# Altium schematic sheet nrf52840_qiaa_var6.SchDoc: nRF52840-QIAA Ref. Layout (LDO only, VDD supply, No USB)
size A4; Revision: 1.1; SheetNumber: 1; SheetTotal: 1; DrawnBy: RUBR; DocumentSize: A4; PCAName: nRF52840-QIAA Ref. Layout (LDO only, VDD supply)
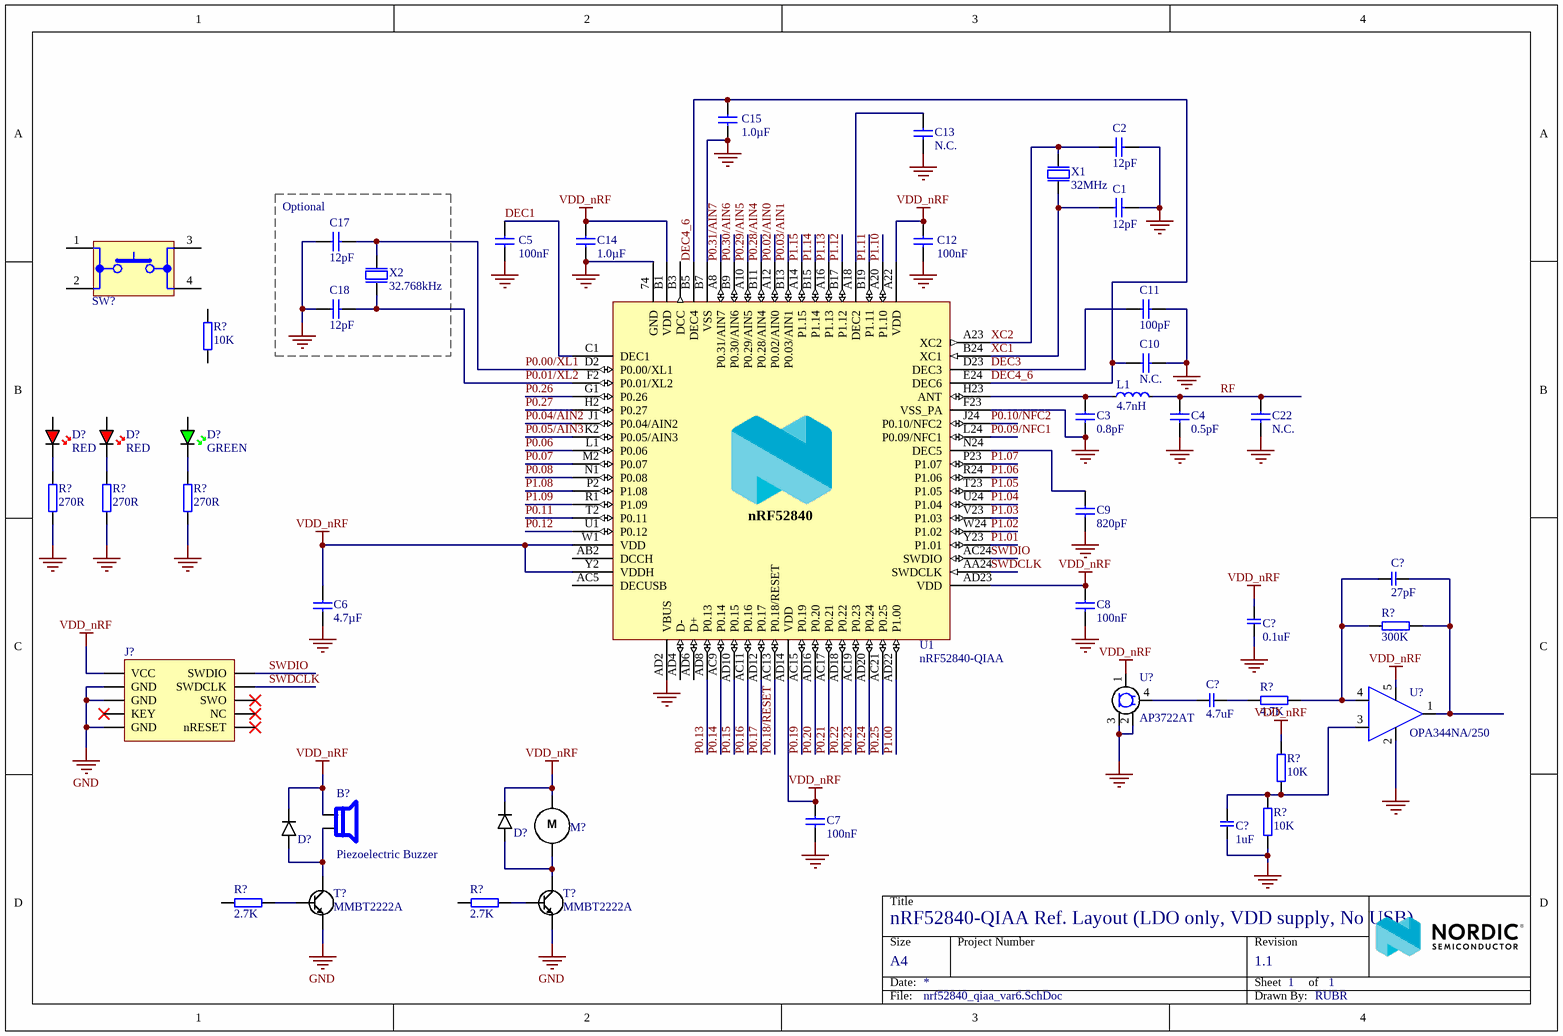
[diagram p0: nrf52840_qiaa_var6.SchDoc]

## Parts
(Parts that share a designator on the sheet are numbered #1, #2 ... from top to bottom, then left to right.)
B?  Piezoelectric Buzzer
C1  12pF  [CAPC1005X04L]
C2  12pF  [CAPC1005X04L]
C3  0.8pF  [CAPC1005X04L]
C4  0.5pF  [CAPC1005X04L]
C5  100nF  [CAPC1005X04L]
C6  4.7µF  [CAPC1608X06L]
C7  100nF  [CAPC1005X04L]
C8  100nF  [CAPC1005X04L]
C9  820pF  [CAPC1005X04L]
C10  N.C.  [CAPC1005X04L]
C11  100pF  [CAPC1005X04L]
C12  100nF  [CAPC1005X04L]
C13  N.C.  [CAPC1005X04L]
C14  1.0µF  [CAPC1608X06L]
C15  1.0µF  [CAPC1608X06L]
C17  12pF  [CAPC1005X04L]
C18  12pF  [CAPC1005X04L]
C22  N.C.  [CAPC1005X04L]
C?#1  27pF  [C0805]
C?#2  0.1uF  [C0805]
C?#3  4.7uF  [C0805]
C?#4  1uF  [C0805]
D?#1  RED  [1206_RED]
D?#2  RED  [1206_RED]
D?#3  GREEN  [1206_GREEN]
D?#4  S1AL  [S1AL]  (value not drawn)
D?#5  S1AL  [S1AL]  (value not drawn)
J?  CONN HEADER SMD 10POS 1.27MM  [Conn_02x05_Odd_Even]  (value not drawn)
L1  4.7nH  [INDC1005X04L]
M?  Motor  [F_HDR_1X2]  (value not drawn)
R?#1  10K  [R0805]
R?#2  270R  [R0805]
R?#3  270R  [R0805]
R?#4  270R  [R0805]
R?#5  300K  [R0805]
R?#6  4.7K  [R0805]
R?#7  10K  [R0805]
R?#8  10K  [R0805]
R?#9  2.7K  [R0805]
R?#10  2.7K  [R0805]
SW?  1825910-6  [Push_Button_SMD_4.5X4.5]  (value not drawn)
T?#1  MMBT2222A  [MMBT2222A]
T?#2  MMBT2222A  [MMBT2222A]
U1  nRF52840-QIAA  [AQFN50P700X700X85_HS-74N]
U?#1  AP3722AT  [AP3722AT]
U?#2  OPA344NA/250  [SOT-23-5]
X1  32MHz  [BT-XTAL_2016]
X2  32.768kHz  [XTAL_3215]

## Blocks framed on the sheet
Optional: C17 C18 X2

## Nets
GND: C1.2 C2.2 C3.1 C4.1 C5.2 C6.2 C7.2 C8.2 C9.2 C10.1 C11.2 C12.2 C13.2 C14.2 C15.1 C17.2 C18.2 C22.2 C?#2.1 C?#4.1 J?.3(GND) J?.5(GND) J?.9(GND) R?#2.2(100R) R?#3.2(100R) R?#4.2(100R) R?#8.2(100R) T?#1.2 T?#2.2 U1.74(GND) U1.AD2(VBUS) U1.B7(VSS) U1.F23(VSS_PA) U?#1.2(GND) U?#1.3(GND) U?#2.2(VEE) X1.2(GND) X1.4(GND)
VDD_nRF: B?.1 C6.1 C7.1 C8.1 C12.1 C14.1 C?#2.2 D?#4.K D?#5.K J?.1(VCC) M?.1 R?#7.1 U1.A22(VDD) U1.AD14(VDD) U1.AD23(VDD) U1.B1(VDD) U1.W1(VDD) U1.Y2(VDDH) U?#1.1(VDD) U?#2.5(VCC)
DEC1: C5.1 U1.C1(DEC1)
DEC3: C11.1 U1.D23(DEC3)
DEC4_6: C10.2 C15.2 U1.B5(DEC4) U1.E24(DEC6)
P0.00/XL1: C17.1 U1.D2(P0.00/XL1) X2.1(inp)
P0.01/XL2: C18.1 U1.F2(P0.01/XL2) X2.2(out)
P0.02/AIN0: U1.A12(P0.02/AIN0)
P0.03/AIN1: U1.B13(P0.03/AIN1)
P0.04/AIN2: U1.J1(P0.04/AIN2)
P0.05/AIN3: U1.K2(P0.05/AIN3)
P0.06: U1.L1(P0.06)
P0.07: U1.M2(P0.07)
P0.08: U1.N1(P0.08)
P0.09/NFC1: U1.L24(P0.09/NFC1)
P0.10/NFC2: U1.J24(P0.10/NFC2)
P0.11: U1.T2(P0.11)
P0.12: U1.U1(P0.12)
P0.13: U1.AD8(P0.13)
P0.14: U1.AC9(P0.14)
P0.15: U1.AD10(P0.15)
P0.16: U1.AC11(P0.16)
P0.17: U1.AD12(P0.17)
P0.18/RESET: U1.AC13(P0.18/RESET)
P0.19: U1.AC15(P0.19)
P0.20: U1.AD16(P0.20)
P0.21: U1.AC17(P0.21)
P0.22: U1.AD18(P0.22)
P0.23: U1.AC19(P0.23)
P0.24: U1.AD20(P0.24)
P0.25: U1.AC21(P0.25)
P0.26: U1.G1(P0.26)
P0.27: U1.H2(P0.27)
P0.28/AIN4: U1.B11(P0.28/AIN4)
P0.29/AIN5: U1.A10(P0.29/AIN5)
P0.30/AIN6: U1.B9(P0.30/AIN6)
P0.31/AIN7: U1.A8(P0.31/AIN7)
P1.00: U1.AD22(P1.00)
P1.01: U1.Y23(P1.01)
P1.02: U1.W24(P1.02)
P1.03: U1.V23(P1.03)
P1.04: U1.U24(P1.04)
P1.05: U1.T23(P1.05)
P1.06: U1.R24(P1.06)
P1.07: U1.P23(P1.07)
P1.08: U1.P2(P1.08)
P1.09: U1.R1(P1.09)
P1.10: U1.A20(P1.10)
P1.11: U1.B19(P1.11)
P1.12: U1.B17(P1.12)
P1.13: U1.A16(P1.13)
P1.14: U1.B15(P1.14)
P1.15: U1.A14(P1.15)
RF: C4.2 C22.1 L1.2
SWDCLK: J?.4(SWDCLK) U1.AA24(SWDCLK)
SWDIO: J?.2(SWDIO) U1.AC24(SWDIO)
XC1: C1.1 U1.B24(XC1) X1.1(inp)
XC2: C2.1 U1.A23(XC2) X1.3(out)
NetB?_2: B?.2 D?#5.A T?#1.3
NetC3_2: C3.2 L1.1 U1.H23(ANT)
NetC9_1: C9.1 U1.N24(DEC5)
NetC13_1: C13.1 U1.A18(DEC2)
NetC?#1_1: C?#1.1 R?#5.1 R?#6.2(100R) U?#2.4(V-)
NetC?#1_2: C?#1.2 R?#5.2(100R) U?#2.1(OUT)
NetC?#3_1: C?#3.1 U?#1.4(OUT)
NetC?#3_2: C?#3.2 R?#6.1
NetC?#4_2: C?#4.2 R?#7.2(100R) R?#8.1 U?#2.3(V+)
NetD?#1_K: D?#1.K R?#2.1
NetD?#2_K: D?#2.K R?#3.1
NetD?#3_K: D?#3.K R?#4.1
NetD?#4_A: D?#4.A M?.2 T?#2.3
NetR?#9_2: R?#9.2(100R) T?#1.1
NetR?#10_2: R?#10.2(100R) T?#2.1

Not connected (* = marked no-connect by the designer): D?#1 A; D?#2 A; D?#3 A; J? 6(SWO)* 7(KEY)* 8(NC)* 10(nRESET)*; R?#1 1 2(100R); R?#9 1; R?#10 1; SW? 1 2 3 4; U1 AB2(DCCH) AC5(DECUSB) AD4(D-) AD6(D+) B3(DCC)

## Notes on the sheet
- Title
- Size
- Date:
- A4
- Project Number
- Sheet         of
- Revision
- File:
- Drawn By:
- (in symbol Motor) M
- (in symbol nRF52840-QIAAD0) nRF52840

## Library data of the parts
B? = GSC14045YB-3V4000: NO 4000±500Hz 75dB @ 3V, 10cm Piezo 3V 14mm x 14mm SMD,14x14x4mm Buzzers ROHS
C1 C2 C17 C18 = C0402-12p: Capacitor, NP0, ±2%; Note: 50V; Part Number: C0402-12p; LatestRevisionDate: 2011-05-11; Pin Count: 2; Publisher: Nordic Semiconductor; Published: 2009-05-08; Value: 12pF; Footprint Doc: 0402
C3 = C0402-0.8p: Capacitor, NP0, ±10%; Note: 50V; Part Number: C0402-0.8p; LatestRevisionDate: 2012-11-21; Pin Count: 2; Publisher: Nordic Semiconductor; Published: 2009-05-08; Value: 0.8pF; Footprint Doc: 0402
C4 = C0402-0.5p: Capacitor, NP0, ±10%; Note: 50V; Part Number: C0402-0.5p; LatestRevisionDate: 2017-02-23; Pin Count: 2; Publisher: Nordic Semiconductor; Published: 2009-05-08; Value: 0.5pF; Footprint Doc: 0402
C5 C7 C8 C12 = C0402-100n: Capacitor, X7R, ±10%; Note: 16V; Part Number: C0402-100n; LatestRevisionDate: 2009-11-23; Pin Count: 2; Publisher: Nordic Semiconductor; Published: 2009-05-08; Value: 100nF; Footprint Doc: 0402
C6 = C0603-4µ7-6.3V-X7R: Capacitor, X7R, ±10%; Note: 6.3V; Part Number: C0603-4µ7-6.3V-X7R; LatestRevisionDate: 2015-06-10; Pin Count: 2; Publisher: Nordic Semiconductor; Published: 2015-06-10; Value: 4.7µF; Footprint Doc: 0603
C9 = C0402-820p: Capacitor, NP0, ±5%; Note: 50V; Part Number: C0402-820p; LatestRevisionDate: 2009-05-08; Pin Count: 2; Publisher: Nordic Semiconductor; Published: 2009-05-08; Value: 820pF; Footprint Doc: 0402
C10 C13 = C0402-N.C.: Not mounted; Assembly: Not mounted; Part Number: C0402-N.C.; LatestRevisionDate: 2009-05-08; Pin Count: 2; Publisher: Nordic Semiconductor; Published: 2009-05-08; Value: N.C.; Footprint Doc: 0402
C11 = C0402-100p: Capacitor, NP0, ±5%; Note: 50V; Part Number: C0402-100p; LatestRevisionDate: 2009-05-08; Pin Count: 2; Publisher: Nordic Semiconductor; Published: 2009-05-08; Value: 100pF; Footprint Doc: 0402
C14 C15 = C0603-1µ0: Capacitor, X7R, ±10%; Note: 16V; Part Number: C0603-1µ0; LatestRevisionDate: 2013-06-05; Pin Count: 2; Publisher: Nordic Semiconductor; Published: 2009-05-08; Value: 1.0µF; Footprint Doc: 0603
C22 = C0402-N.C.: Not mounted; Note: Chip Cap; Assembly: Not mounted; Part Number: C0402-N.C.; LatestRevisionDate: 2009-05-08; Pin Count: 2; Publisher: Nordic Semiconductor; Published: 2009-05-08; Value: N.C.; Footprint Doc: 0402
D?#1 D?#2 = MHS110KECT: Red 617.5~629.5nm 1.8V - 1204 Light Emitting Diodes (LED) ROHS
D?#3 = TJ-S3210SW5TGLC7K-A5: Green-yellow 565~575nm 1.8~2.4V - SMD Light Emitting Diodes (LED) ROHS
D?#4 D?#5 = S1AL: Manufacturer: Taiwan Semiconductor; Manufacturer Part Number: RS1AL RVG; Supplier 1: Digi-Key; RoHS: Yes; Stock 1: 64; Pricing 1: 1=0.40000, 10=0.32100, 100=0.21860, 500=0.16394, 1000=0.12296 (USD); RoHS Compliant: Yes; Supplier Part Number 1: RS1ALRVGCT-ND
J? = Conn_02x05_Odd_Even: Mini SWD 0.05" Pitch Connector - 10 Pin SMT Box Header; Manufacturer: Adafruit Industries; Manufacturer Part Number: 4048; Supplier 1: Digi-Key; RoHS: No; Category: Connectors; Stock 1: 76; Pricing 1: 1=1.95000 (USD); ComponentLink1URL: https://media.digikey.com/pdf/Data%20Sheets/Adafruit%20PDFs/4048_Web.pdf?src-supplier=Digi-Key; ComponentLink1Description: https://media.digikey.com/pdf/Data%20Sheets/Adafruit%20PDFs/4048_Web.pdf?src-supplier=Digi-Key; Supplier Part Number 1: 1528-2827-ND
L1 = L0402-4n7: High frequency chip inductor ±5%; Part Number: L0402-4n7; LatestRevisionDate: 2012-09-19; Pin Count: 2; Publisher: Nordic Semiconductor; Published: 2009-05-08; Value: 4.7nH; Note: High frequency chip inductor ±5%; Footprint Doc: 0402
R?#9 R?#10 = R0805_2K7: RES SMD 2.7K OHM 1% 1/8W 0805; Manufacturer: Yageo; Manufacturer Part Number: AC0805FR-072K7L; Resistance: 2.7kR; Power Rating: 125mW; Voltage Rating: 150V; Temperature Coefficient: 100ppm/°C; Supplier 1: Digi-Key; RoHS: Yes; Category: Chip SMD Resistors; Stock 1: 3849; Pricing 1: 1=0.10000, 10=0.05000, 100=0.02040, 1000=0.00917, 2500=0.00796 (USD); Case/Package: 0805; Case Code (Imperial): 0805; Case Code (Metric): 2012; Size Code: 0805; Min Operating Temperature: -55°C; Max Operating Temperature: 155°C; Tolerance: 1%; Packaging: Tape and Reel; Resistor Type: Thick Film; Number of Terminations: 2; Termination: SMD/SMT; Max Power Dissipation: 125mW; Features: Moisture Resistant,Automotive AEC-Q200; Series: AC; Length: 0.079inch; Width: 0.049inch; Height: 0.024inch; Lead Free: Lead Free; RoHS Compliant: Yes; ComponentLink1URL: https://datasheet.ciiva.com/12656/pyu-ac-51-rohs-l-2-12656732.pdf?src-supplier=Mouser; ComponentLink1Description: https://datasheet.ciiva.com/12656/pyu-ac-51-rohs-l-2-12656732.pdf?src-supplier=Mouser; Supplier Part Number 1: YAG3717CT-ND
SW? = Push Button: Switch Push Button OFF (ON) SPST Round Button 0.05A 24VDC Momentary Contact PC Pins Thru-Hole; Manufacturer: TE Connectivity Alcoswitch; Actuator Material: PBT; Mechanical Life: 100000Cycles; Operating Force: 160gf; Illumination Type: Illuminated,Non-Illuminated; Switch Travel: 0.25mm; Switch Function: Off-Mom; Actuator Type: Standard; Max Voltage Rating (DC): 24V; Contact Current Rating: 50mA; Contact Resistance: 100mR; Actuator Length: 0.055inch; Supplier 1: Digi-Key; Stock 1: 56143; Pricing 1: 1=0.1, 10=0.093, 25=0.0892, 50=0.0862, 100=0.0814, 250=0.0766, 500=0.0734, 1000=0.05584, 5000=0.04627 (USD); Mount: Through Hole; Contact Material: Copper Alloy; Contact Plating: Silver; Min Operating Temperature: -35°C; Max Operating Temperature: 85°C; Throw Configuration: SPST; Packaging: Loose Piece; Termination: PC Pins; Package Quantity: 750; Orientation: Straight; Electrical Life: 100000Cycles; Type: Switch; Max Current Rating: 50mA; Length: 5.99mm; REACH SVHC: Unknown; ELV: Compliant; Lead Free: Lead Free; ComponentLink1URL: http://www.onlinecomponents.com/productFiles/mf-AMP/1825910-6rqpn1825910-6.pdf; ComponentLink1Description: http://www.onlinecomponents.com/productFiles/mf-AMP/1825910-6rqpn1825910-6.pdf; ComponentLink2URL: http://www.te.com/commerce/DocumentDelivery/DDEController?Action=srchrtrv&DocNm=1825910&DocType=Customer+Drawing&DocLang=English; ComponentLink2Description: http://www.te.com/commerce/DocumentDelivery/DDEController?Action=srchrtrv&DocNm=1825910&DocType=Customer+Drawing&DocLang=English; Supplier Part Number 1: 450-1650-ND; Manufacturer Part Number: 1825910-6
T?#1 T?#2 = MMBT2222A: TRANS NPN 40V 0.6A SOT-23; Manufacturer: STMicroelectronics; Max Power Dissipation: 350mW; Frequency: 270MHz; hFE Min: 100; Max Collector Current: 600mA; Collector Base Voltage (VCBO): 75V; Emitter Base Voltage (VEBO): 6V; Number of Elements: 1; Element Configuration: Single; Current Rating: 500mA; Collector-emitter Voltage-Max: 1V; Supplier 1: Digi-Key; Manufacturer Part Number: MMBT2222A; RoHS: Yes; Category: BJTs; Mount: Surface Mount; Case/Package: SOT-23; Number of Pins: 3; Min Operating Temperature: -65°C; Max Operating Temperature: 150°C; Package Quantity: 1; Collector Emitter Voltage (VCEO): 40V; Packaging: Tape and Reel; Transition Frequency: 270MHz; Polarity: NPN; Collector Emitter Breakdown Voltage: 40V; Power Dissipation: 350mW; Gain Bandwidth Product: 270MHz; Max Breakdown Voltage: 40V; Voltage Rating (DC): 40V; Series: -; Radiation Hardening: No; REACH SVHC: No SVHC; Lead Free: Lead Free; RoHS Compliant: Yes; ComponentLink1URL: https://datasheet.ciiva.com/16286/cd00003176-315443-16286091.pdf?src-supplier=Mouser; ComponentLink1Description: https://datasheet.ciiva.com/16286/cd00003176-315443-16286091.pdf?src-supplier=Mouser; ComponentLink2URL: https://datasheet.ciiva.com/985/cd00003176-985312.pdf?src-supplier=Digi-Key; ComponentLink2Description: https://datasheet.ciiva.com/985/cd00003176-985312.pdf?src-supplier=Digi-Key; Supplier Part Number 1: 497-2479-1-ND
U1 = nRF52840-QIAAD0: Multi-protocol Bluetooth Low Energy, IEEE 802.15.4, ANT and 2.4GHz proprietary system-on-chip; Manufacturer: Nordic Semiconductor; Part Number: nRF52840-QIAAD0; LatestRevisionDate: 2018-12-04; Pin Count: 73; Publisher: Nordic Semiconductor; Published: 2018-12-04; Value: nRF52840-QIAA; Note: *; Footprint Doc: AQFN-73; Manufacturer Part Number: nRF52840-QIAAD0
U?#2 = OPA344NA/250: IC OPAMP GP 1MHZ RRO SOT23-5; Manufacturer: Texas Instruments; Nominal Supply Current: 250uA; Min Supply Voltage: 2.7V; Max Supply Voltage: 5.5V; Voltage Gain: 122dB; Common Mode Rejection Ratio: 76dB; Number of Channels: 1; Slew Rate: 0.8V/µs; Max I/O Voltage: 1mV; Input Bias Current: 10pA; Output Current per Channel: 15mA; Power Supply Rejection Ratio (PSRR): 90.46dB; Quiescent Current: 250mA; Amplifier Type: GENERAL PURPOSE; Supplier 1: Digi-Key; Manufacturer Part Number: OPA344NA/250; RoHS: Yes; Category: Amplifiers - Op Amps, Buffer, Instrumentation; Stock 1: 4320; Pricing 1: 1=1.80000, 10=1.61800, 25=1.52640, 100=1.30050 (USD); Case/Package: SOT-23; Number of Pins: 5; Min Operating Temperature: -40°C; Max Operating Temperature: 85°C; Packaging: Tape and Reel; Package Quantity: 250; Bandwidth: 1MHz; Unity Gain Bandwidth Product: 1MHz; Input Offset Voltage (Vos): 1mV; Gain Bandwidth Product: 1MHz; Number of Circuits: 1; Number of Amplifiers: 1; Number of Elements: 1; Supply Current: 250uA; Technology: CMOS; Length: 2.9mm; Width: 1.6mm; Height: 1.15mm; Radiation Hardening: No; REACH SVHC: No SVHC; Lead Free: Lead Free; RoHS Compliant: Yes; ComponentLink1URL: https://datasheet.ciiva.com/7219/opa4344-7219632.pdf?src-supplier=Newark; ComponentLink1Description: https://datasheet.ciiva.com/7219/opa4344-7219632.pdf?src-supplier=Newark; ComponentLink2URL: https://datasheet.ciiva.com/7738/1446265-7738626.pdf?src-supplier=Element14; ComponentLink2Description: https://datasheet.ciiva.com/7738/1446265-7738626.pdf?src-supplier=Element14; ComponentLink3URL: https://datasheet.ciiva.com/1797/opa344-1797748.pdf?src-supplier=Digi-Key; ComponentLink3Description: https://datasheet.ciiva.com/1797/opa344-1797748.pdf?src-supplier=Digi-Key; ComponentLink4URL: https://datasheet.ciiva.com/1797/opa344-1797749.pdf?src-supplier=Digi-Key; ComponentLink4Description: https://datasheet.ciiva.com/1797/opa344-1797749.pdf?src-supplier=Digi-Key; ComponentLink5URL: https://datasheet.ciiva.com/26226/opa344-26226533.pdf?src-supplier=Avnet+Europe; ComponentLink5Description: https://datasheet.ciiva.com/26226/opa344-26226533.pdf?src-supplier=Avnet+Europe; ComponentLink6URL: https://datasheet.ciiva.com/1797/opa344-1797750.pdf?src-supplier=Digi-Key; ComponentLink6Description: https://datasheet.ciiva.com/1797/opa344-1797750.pdf?src-supplier=Digi-Key; ComponentLink7URL: https://datasheet.ciiva.com/2974/opa344-2974008.pdf?src-supplier=Avnet; ComponentLink7Description: https://datasheet.ciiva.com/2974/opa344-2974008.pdf?src-supplier=Avnet; ComponentLink8URL: https://datasheet.ciiva.com/2974/opa344-2974009.pdf?src-supplier=Avnet; ComponentLink8Description: https://datasheet.ciiva.com/2974/opa344-2974009.pdf?src-supplier=Avnet; ComponentLink9URL: https://datasheet.ciiva.com/46391/1882856-46391995.pdf?src-supplier=Element14; ComponentLink9Description: https://datasheet.ciiva.com/46391/1882856-46391995.pdf?src-supplier=Element14; ComponentLink10URL: https://datasheet.ciiva.com/46391/1882856-46391996.pdf?src-supplier=Element14; ComponentLink10Description: https://datasheet.ciiva.com/46391/1882856-46391996.pdf?src-supplier=Element14
X1 = XTAL_SMD2016_32MHz_8pF_General: XTAL SMD 2016, 32MHz, Cl=8pF, Total Tol: ±40ppm; Part Number: XTAL_SMD2016_32MHz_8pF_General; LatestRevisionDate: 2016-08-19; Pin Count: 4; Publisher: Nordic Semiconductor; Published: 2016-08-19; Value: 32MHz; Footprint Doc: XTAL_2016
X2 = XTAL_SMD3215_32.768kHz_9pF_General: XTAL SMD 3215, 32.768kHz, Cl=9pF, Total Tol: ±50ppm; Part Number: XTAL_SMD3215_32.768kHz_9pF_General; LatestRevisionDate: 2016-08-19; Pin Count: 2; Publisher: Nordic Semiconductor; Published: 2016-08-19; Value: 32.768kHz; Footprint Doc: XTAL_3215